# EAGLE design Int_Termostat (EAGLE 6.5.0)
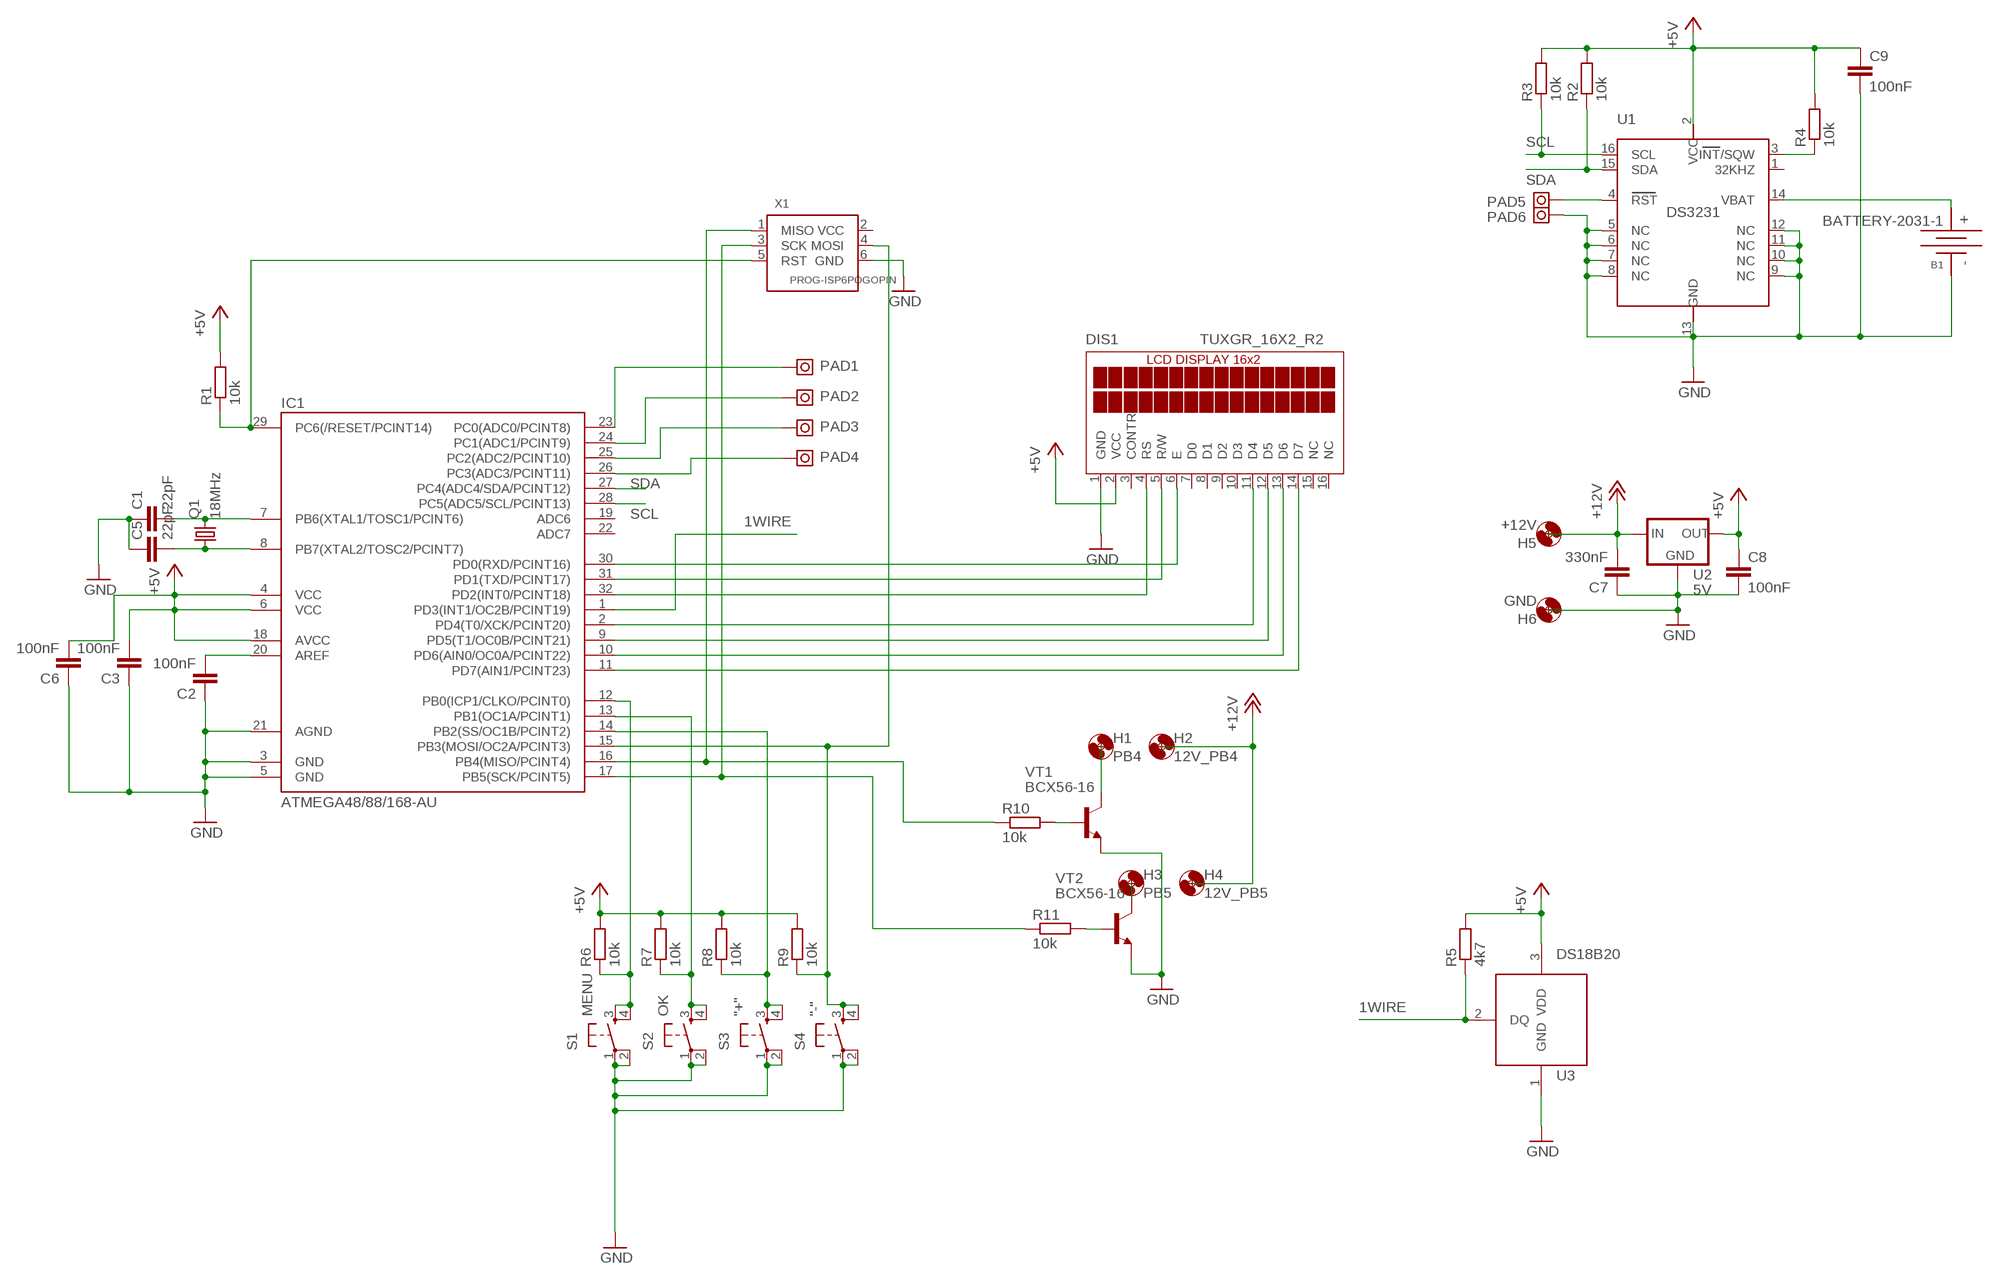
[diagram p0: schematic, sheet 1]

## Parts
B1  BATTERY-2031-1  [BTH2032-1]
C1  22pF  C-EUC0805  [C0805]
C2  100nF  C-EUC0805  [C0805]
C3  100nF  C-EUC0805  [C0805]
C5  22pF  C-EUC0805  [C0805]
C6  100nF  C-EUC0805  [C0805]
C7  330nF  C-EUC0805  [C0805]
C8  100nF  C-EUC0805  [C0805]
C9  100nF  C-EUC0805  [C0805]
DIS1  TUXGR_16X2_R2  [TUXGR_16X2_R2]
H1  PB4  MOUNT-HOLE3.0  [3,0]
H2  12V_PB4  MOUNT-HOLE3.0  [3,0]
H3  PB5  MOUNT-HOLE3.0  [3,0]
H4  12V_PB5  MOUNT-HOLE3.0  [3,0]
H5  +12V  MOUNT-HOLE3.0  [3,0]
H6  GND  MOUNT-HOLE3.0  [3,0]
IC1  ATMEGA48/88/168-AU  [TQFP32-08]
PAD1  PC0  PAD  [PAD]
PAD2  PC1  PAD  [PAD]
PAD3  PC2  PAD  [PAD]
PAD4  PC3  PAD  [PAD]
PAD5  RST  PAD  [PAD]
PAD6  RST  PAD  [PAD]
Q1  18MHz  CRYSTALHC49S  [HC49/S]
R1  10k  R-EU_R0603  [R0603]
R2  10k  R-EU_R0603  [R0603]
R3  10k  R-EU_R0603  [R0603]
R4  10k  R-EU_R0603  [R0603]
R5  4k7  R-EU_R0603  [R0603]
R6  10k  R-EU_R0603  [R0603]
R7  10k  R-EU_R0603  [R0603]
R8  10k  R-EU_R0603  [R0603]
R9  10k  R-EU_R0603  [R0603]
R10  10k  R-EU_R0603  [R0603]
R11  10k  R-EU_R0603  [R0603]
S1  MENU  DTS-6  [DTS-6]
S2  OK  DTS-6  [DTS-6]
S3  "+"  DTS-6  [DTS-6]
S4  "-"  DTS-6  [DTS-6]
U1  DS3231  [SO16]
U2  5V  L78XX/TO263  [TO263]
U3  DS18B20  [TO92]
VT1  BCX56-16  [SOT89-ECB]
VT2  BCX56-16  [SOT89-ECB]
X1  PROG-ISP6POGOPIN  [PROG_POGOPIN]

## Nets
1WIRE: IC1.1(PD3(INT1/OC2B/PCINT19)) R5.1 U3.2(DQ)
+5V: C3.2 C6.2 C8.1 C9.1 DIS1.2(VCC) IC1.4(VCC) IC1.6(VCC) IC1.18(AVCC) R1.2 R2.2 R3.2 R4.2 R5.2 R6.2 R7.2 R8.2 R9.2 U1.2(VCC) U2.2(OUT) U3.3(VDD)
+12V: C7.2 H2.P$1 H4.P$1 H5.P$1 U2.1(IN)
GND: B1.- C1.1 C2.1 C3.1 C5.1 C6.1 C7.1 C8.2 C9.2 DIS1.1(GND) H6.P$1 IC1.3(GND) IC1.5(GND) IC1.21(AGND) PAD6.P$1(PAD) S1.1 S1.2 S2.1 S2.2 S3.1 S3.2 S4.1 S4.2 U1.5(NC) U1.6(NC) U1.7(NC) U1.8(NC) U1.9(NC) U1.10(NC) U1.11(NC) U1.12(NC) U1.13(GND) U2.3(GND) U3.1(GND) VT1.E VT2.E X1.6(GND)
N$1: C1.2 IC1.7(PB6(XTAL1/TOSC1/PCINT6)) Q1.2
N$2: C5.2 IC1.8(PB7(XTAL2/TOSC2/PCINT7)) Q1.1
N$3: C2.2 IC1.20(AREF)
N$4: IC1.17(PB5(SCK/PCINT5)) R11.1 X1.3(SCK)
N$5: IC1.16(PB4(MISO/PCINT4)) R10.1 X1.1(MISO)
N$6: IC1.15(PB3(MOSI/OC2A/PCINT3)) R9.1 S4.3 S4.4 X1.4(MOSI)
N$7: B1.+ U1.14(VBAT)
N$9: IC1.29(PC6(/RESET/PCINT14)) R1.1 X1.5(RST)
N$10: R4.1 U1.3(INT/SQW)
N$11: DIS1.6(E) IC1.30(PD0(RXD/PCINT16))
N$12: DIS1.5(R/W) IC1.31(PD1(TXD/PCINT17))
N$13: DIS1.4(RS) IC1.32(PD2(INT0/PCINT18))
N$14: DIS1.11(D4) IC1.2(PD4(T0/XCK/PCINT20))
N$15: DIS1.12(D5) IC1.9(PD5(T1/OC0B/PCINT21))
N$16: DIS1.13(D6) IC1.10(PD6(AIN0/OC0A/PCINT22))
N$17: DIS1.14(D7) IC1.11(PD7(AIN1/PCINT23))
N$18: PAD5.P$1(PAD) U1.4(RST)
N$19: IC1.12(PB0(ICP1/CLKO/PCINT0)) R6.1 S1.3 S1.4
N$20: IC1.13(PB1(OC1A/PCINT1)) R7.1 S2.3 S2.4
N$21: IC1.14(PB2(SS/OC1B/PCINT2)) R8.1 S3.3 S3.4
N$22: H3.P$1 VT2.C VT2.C@1(C)
N$23: R10.2 VT1.B
N$24: R11.2 VT2.B
N$25: H1.P$1 VT1.C VT1.C@1(C)
N$26: IC1.23(PC0(ADC0/PCINT8)) PAD1.P$1(PAD)
N$27: IC1.24(PC1(ADC1/PCINT9)) PAD2.P$1(PAD)
N$28: IC1.25(PC2(ADC2/PCINT10)) PAD3.P$1(PAD)
N$29: IC1.26(PC3(ADC3/PCINT11)) PAD4.P$1(PAD)
SCL: IC1.28(PC5(ADC5/SCL/PCINT13)) R3.1 U1.16(SCL)
SDA: IC1.27(PC4(ADC4/SDA/PCINT12)) R2.1 U1.15(SDA)
Unconnected: DIS1.3(CONTR) DIS1.7(D0) DIS1.8(D1) DIS1.9(D2) DIS1.10(D3) DIS1.15(NC) DIS1.16(NC) IC1.19(ADC6) IC1.22(ADC7) U1.1(32KHZ) X1.2(VCC)

## Library data of the parts
B1 = usb:BATTERY
C1-C3 C5-C9 = rcl:C-EU: CAPACITOR, European symbol
DIS1 = display-lcd:TUXGR_16X2_R2: Tuxgraphics LCD display 16x2 characters reflective, without background light Source: tuxgr_12x2_r2.pdf; OC_FARNELL: unknown; OC_NEWARK: unknown
H1-H6 = holes:MOUNT-HOLE: MOUNTING HOLE with drill center marker
IC1 = atmega8:ATMEGA48/88/168
PAD1-PAD6 = usb:PAD
Q1 = crystal:CRYSTAL: CRYSTAL; OC_FARNELL: 1667008; OC_NEWARK: unknown
R1-R11 = rcl:R-EU_: RESISTOR, European symbol
S1-S4 = switch-tact:DTS-6
U1 = usb:DS3231
U2 = v-reg:L78XX/TO263
U3 = usb:DS18B20: DS18B20
VT1 VT2 = usb:BCX56-16
X1 = usb:PROG-ISP

## Board
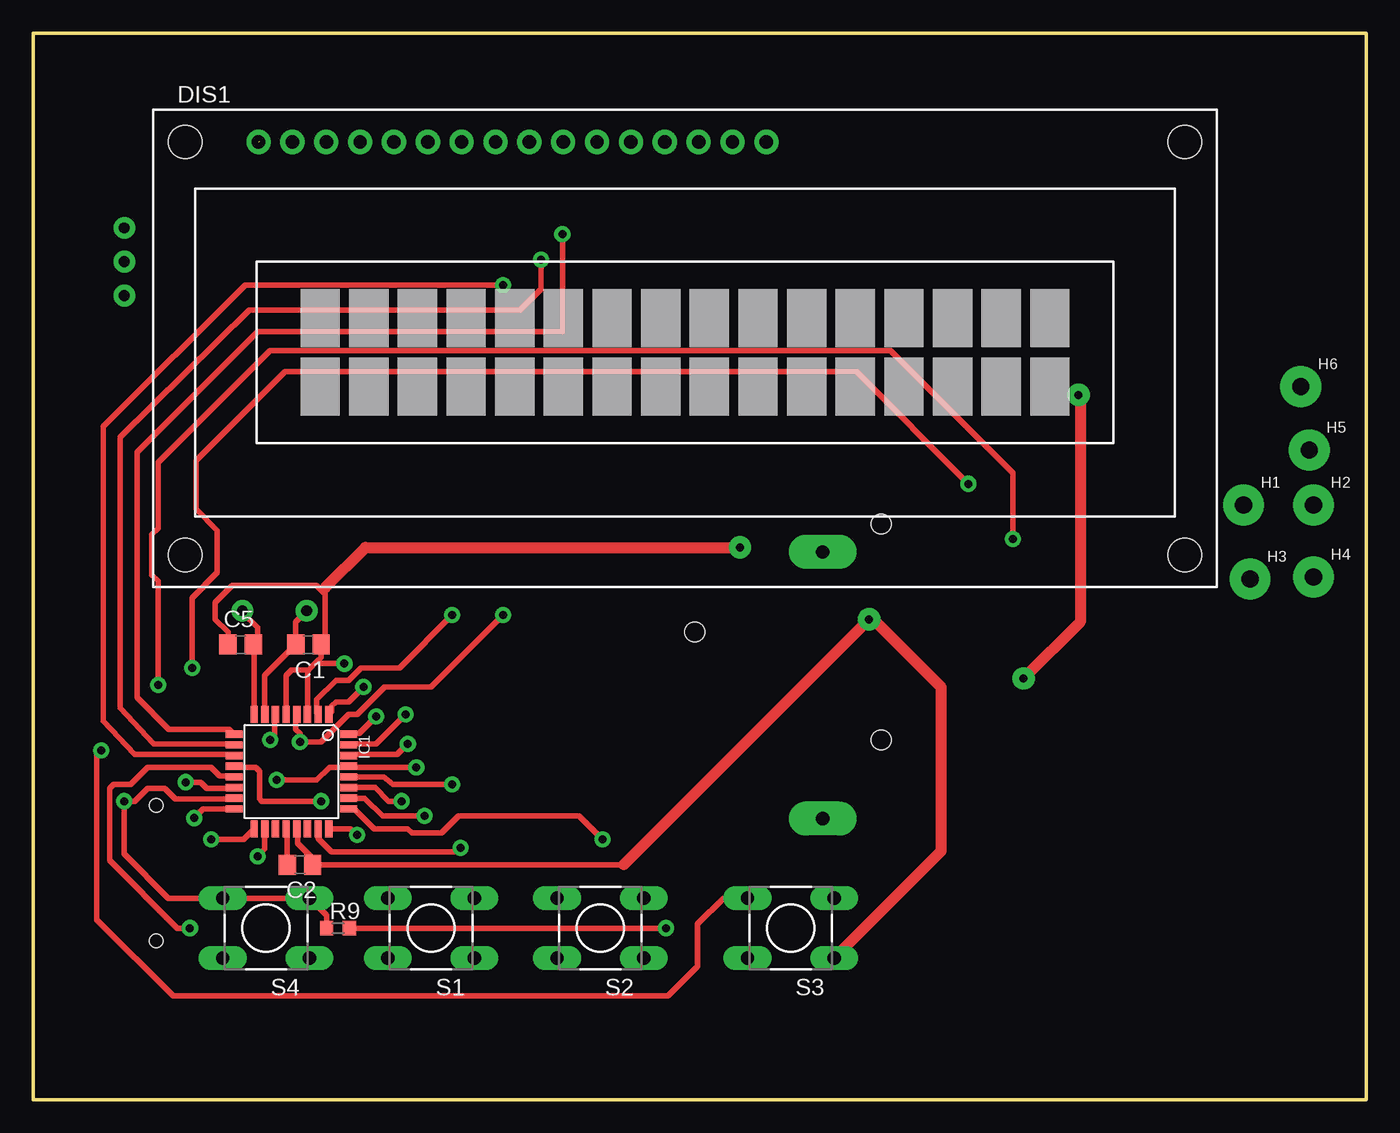
[diagram p1: board, top side]
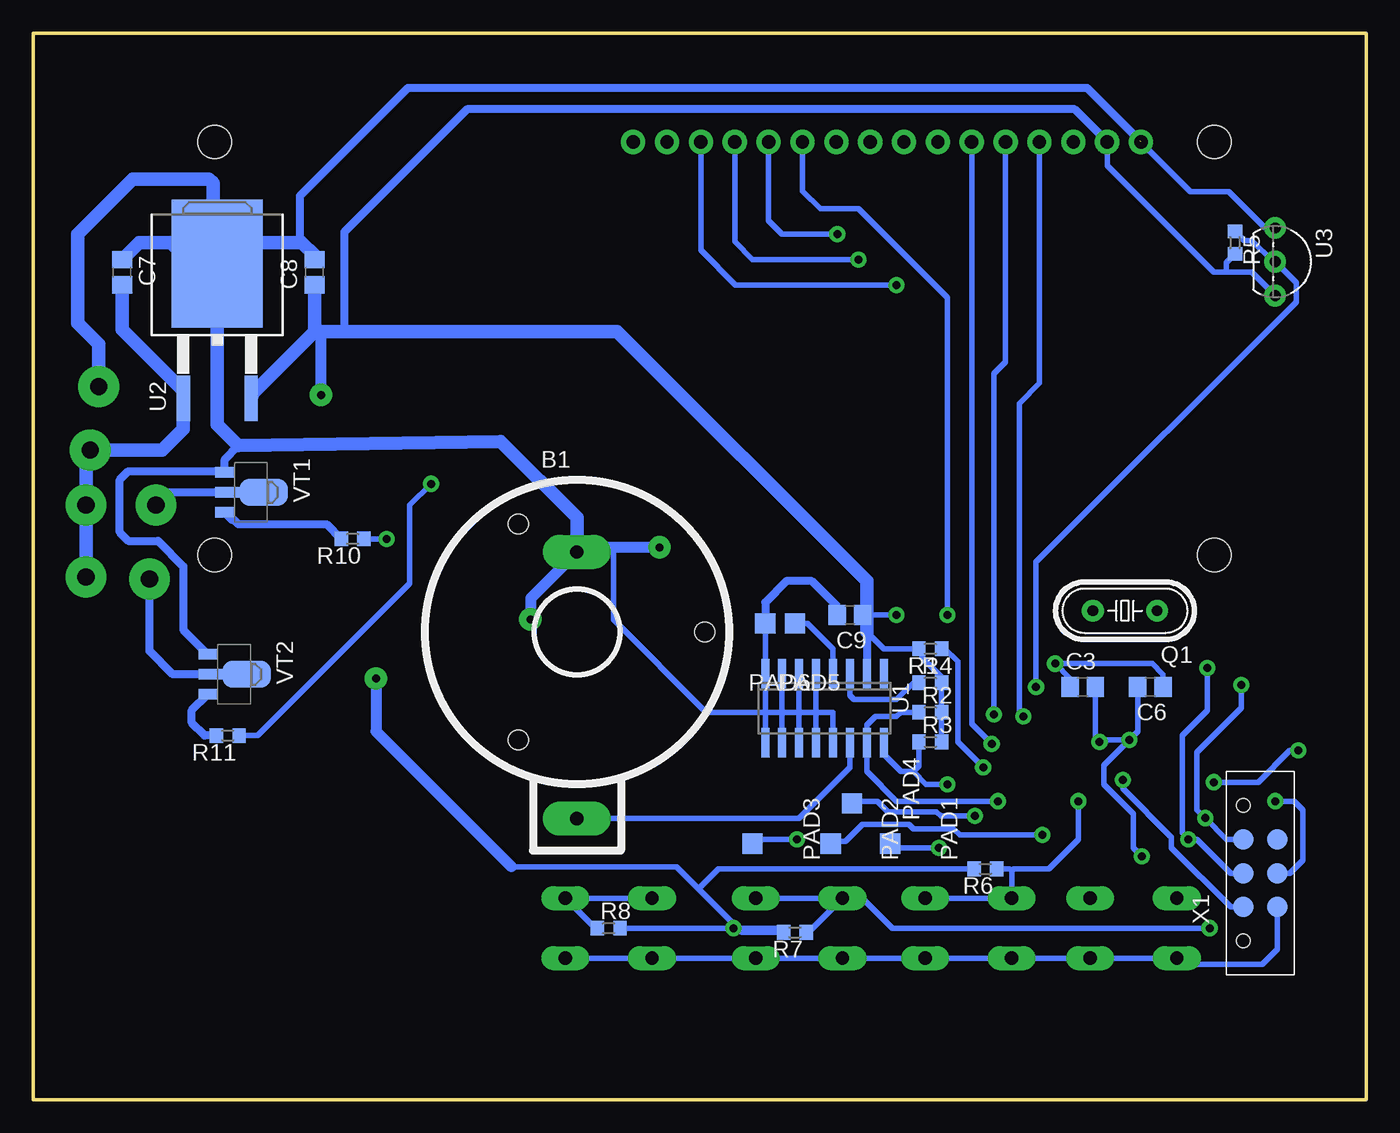
[diagram p2: board, bottom side, seen from below]

Size 100 x 80 mm. Coordinates in mm from the lower left corner, seen from the top.
Outline: 0,0 100,0 100,80 0,80 0,0
Copper layers (1*16): Top 0.035mm / dielectric 1.5mm / Bottom 0.035mm
Design rules "default": minimum track width 12mil, minimum drill 32mil, track to track 12mil, track to pad 12mil, pad to pad 12mil, via to via 12mil, smd to smd 8mil, copper to edge 40mil, drill to drill 8mil, minimum pad ring 16mil, minimum via ring 12mil, stop-mask expansion 4mil, vias tented up to drill 0mil, thermal gap 20mil

### Footprints (pad centres in the part's own frame; a part is rotated, then mirrored left to right if it is on the bottom)
BTH2032-1 = drill 1 pad 2.54 long: + 0,-14; - 0,6 | hole 1.5: -4.4,8.1; -4.4,-8.1; 9.6,0
C0805 = smd 1.3 x 1.5: 1 -0.95,0; 2 0.95,0
TUXGR_16X2_R2 = drill 1 pad 1.676: 1 -32,15.5; 2 -29.46,15.5; 3 -26.92,15.5; 4 -24.38,15.5; 5 -21.84,15.5; 6 -19.3,15.5; 7 -16.76,15.5; 8 -14.22,15.5; 9 -11.68,15.5; 10 -9.14,15.5; 11 -6.6,15.5; 12 -4.06,15.5; 13 -1.52,15.5; 14 1.02,15.5; 15 3.56,15.5; 16 6.1,15.5 | hole 2.5: -37.5,-15.5; 37.5,-15.5; -37.5,15.5; 37.5,15.5
3,0 = drill 1.3 pad 3.048: P$1 0,0
TQFP32-08 = smd 1.27 x 0.559: 1 -4.293,2.8; 2 -4.293,2; 3 -4.293,1.2; 4 -4.293,0.4; 5 -4.293,-0.4; 6 -4.293,-1.2; 7 -4.293,-2; 8 -4.293,-2.8; 17 4.293,-2.8; 18 4.293,-2; 19 4.293,-1.2; 20 4.293,-0.4; 21 4.293,0.4; 22 4.293,1.2; 23 4.293,2; 24 4.293,2.8 | smd 0.559 x 1.27: 9 -2.8,-4.293; 10 -2,-4.293; 11 -1.2,-4.293; 12 -0.4,-4.293; 13 0.4,-4.293; 14 1.2,-4.293; 15 2,-4.293; 16 2.8,-4.293; 25 2.8,4.293; 26 2,4.293; 27 1.2,4.293; 28 0.4,4.293; 29 -0.4,4.293; 30 -1.2,4.293; 31 -2,4.293; 32 -2.8,4.293
PAD = smd 1.524 x 1.524: P$1 0,0
HC49/S = drill 0.813: 1 -2.413,0; 2 2.413,0
R0603 = smd 1 x 1.1: 1 -0.85,0; 2 0.85,0
DTS-6 = drill 1 long: 1 -3.25,2.25; 2 3.25,2.25; 3 -3.25,-2.25; 4 3.25,-2.25
SO16 = smd 0.6 x 2.2: 1 -4.445,-2.6; 2 -3.175,-2.6; 3 -1.905,-2.6; 4 -0.635,-2.6; 5 0.635,-2.6; 6 1.905,-2.6; 7 3.175,-2.6; 8 4.445,-2.6; 9 4.445,2.6; 10 3.175,2.6; 11 1.905,2.6; 12 0.635,2.6; 13 -0.635,2.6; 14 -1.905,2.6; 15 -3.175,2.6; 16 -4.445,2.6
TO263 = smd 1 x 3.4: 1 -2.54,-6.6; 2 2.54,-6.6 | smd 6.8 x 9.6: 3 0,3.5
TO92 = drill 0.813: 1 -2.54,0; 2 0,0; 3 2.54,0
SOT89-ECB = smd 0.8 x 1.4: B 1.499,-1.981; E -1.499,-1.981 | smd 0.8 x 1.9: C 0,-1.727 | smd 2.032 x 3.65: C@1 0,0.94
PROG_POGOPIN = smd 1.524 x 1.524: 1 0,7.62; 2 2.54,7.62; 3 0,5.08; 4 2.54,5.08; 5 0,2.54; 6 2.54,2.54 | hole 1.016: 0,0; 0,10.16

### Placement (x,y rotation side)
B1  59.21,35.08 0 bottom
C1  20.64,34.13 180 top
C2  20,17.62 180 top
C3  21.27,30.96 0 bottom
C5  15.56,34.13 0 top
C6  16.19,30.96 180 bottom
C7  93.34,62.07 270 bottom
C8  78.9,62.07 90 bottom
C9  38.73,36.35 180 bottom
DIS1  48.9,56.36 0 top
H1  90.81,44.61 0 top
H2  96.04,44.61 0 top
H3  91.28,39.05 0 top
H4  96.04,39.21 0 top
H5  95.73,48.74 0 top
H6  95.09,53.5 0 top
IC1  19.37,24.61 270 top
PAD1  35.72,19.21 90 bottom
PAD2  40.16,19.21 90 bottom
PAD3  46.04,19.21 90 bottom
PAD4  38.58,22.23 90 bottom
PAD5  42.86,35.72 0 bottom
PAD6  45.09,35.72 0 bottom
Q1  18.1,36.67 180 bottom
R1  32.7,33.81 180 bottom
R2  32.7,29.05 0 bottom
R3  32.7,26.83 0 bottom
R4  32.7,31.27 0 bottom
R5  9.84,64.29 270 bottom
R6  28.57,17.3 180 bottom
R7  42.86,12.54 180 bottom
R8  56.83,12.86 0 bottom
R9  22.86,12.86 0 top
R10  76.04,42.07 180 bottom
R11  85.41,27.3 180 bottom
S1  29.84,12.86 180 top
S2  42.55,12.86 180 top
S3  56.83,12.86 180 top
S4  17.46,12.86 180 top
U1  40.64,29.37 180 bottom
U2  86.2,59.21 0 bottom
U3  6.83,62.87 270 bottom
VT1  83.66,45.56 270 bottom
VT2  84.93,31.91 270 bottom
X1  9.21,11.91 0 bottom

### Tracks (layer width: path | path; a pad name or v marks a point on that pad's centre or on a via)
1WIRE  (via drill 0.6)
  Top 0.406: v24.77,30.96 23.65,29.84 22.7,29.84 22.38,29.53 22.38,29.11 IC1.1
  Bottom 0.406: R5.1 9.15,64.45 8.57,64.45 6.99,62.87 U3.2 5.24,61.28 5.24,59.85 24.77,40.32 v24.77,30.96
+5V  (via drill 0.6, 0.6 pad 1.68)
  Top 0.406: IC1.4 19.68,28.82 19.68,27.78 20,27.46 v20,26.83 21.59,26.83 23.65,28.89 24.29,28.89 26.35,30.96 29.84,30.96 v35.24,36.35 | v17.78,26.99 17.78,27.15 18.1,27.46 18.1,28.83 IC1.6 | IC1.18 17.37,18.8 v16.83,18.26 | 78.58,52.7 v78.42,52.86 | R9.2 v47.47,12.86
  Top 0.813: v74.3,31.59 78.58,35.88 78.58,52.7
  Bottom 0.406: C3.2 20.32,26.99 v20,26.83 19.84,26.99 v17.78,26.99 | C6.2 17.14,27.62 v17.78,26.99 | R3.2 R2.2 R4.2 31.85,31.69 33.34,33.18 33.34,33.6 R1.2 36.2,33.81 37.47,35.08 | U3.3 8.57,62.07 10.48,62.07 | 10.48,62.07 11.43,62.07 19.43,70.08 DIS1.2 | R5.2 10.48,62.81 10.48,62.07 | v35.24,36.35 C9.1 37.47,36.35 37.47,36.2 | v16.83,18.26 17.46,18.89 17.46,21.43 19.68,23.65 19.68,25.08 v17.78,26.99 | R8.2 v47.47,12.86 44.03,12.86 R7.2 46.83,12.54 50.09,15.8 | 50.09,15.8 51.75,17.46 64.14,17.46 | 78.42,57.31 78.74,57.63 | R6.2 48.58,17.3 50.09,15.8
  Bottom 0.61: 37.47,35.08 U1.2 | DIS1.2 21.87,74.3 67.47,74.3 76.68,65.09 76.68,57.63
  Bottom 0.813: v78.42,52.86 78.42,57.31 | v74.3,31.59 74.3,27.62 64.14,17.46
  Bottom 1.016: C8.1 78.9,57.63 | 78.9,57.63 83.5,53.02 U2.2 | 78.9,57.63 78.74,57.63 76.68,57.63 56.2,57.63 37.47,38.89 37.47,36.2 37.47,35.08
+12V
  Bottom 1.016: C7.2 93.34,57.78 88.74,53.18 U2.1 88.74,50.32 90.33,48.74 H5.P$1 96.04,48.42 H2.P$1 H4.P$1
GND  (via drill 0.6, 0.6 pad 1.68)  (1 unrouted)
  Top 0.406: C5.1 14.61,35.08 13.65,36.04 13.65,37.31 14.92,38.58 21.27,38.58 21.91,37.94 | 21.91,37.94 21.91,34.45 | 21.91,34.45 C1.1 21.59,33.18 | 21.59,33.18 21.27,32.86 | 21.27,32.86 20.64,32.23 | IC1.3 20.57,32.16 20.64,32.23 | v23.34,32.7 21.59,32.7 21.27,32.86 | IC1.5 18.97,31.83 19.37,32.23 20.64,32.23 | 21.59,33.18 C1.1 21.91,34.45 | 21.91,37.94 21.91,38.42 | IC1.21 19.84,20.24 19.84,19.21 20.95,18.1 C2.1 44.29,17.62 | v62.71,36.04 63.02,36.04
  Top 0.813: 21.91,38.42 24.92,41.43 v53.02,41.43 | 44.29,17.62 v62.71,36.04 | 63.02,36.04 68.1,30.96 68.1,18.63 S3.1
  Bottom 0.406: C3.1 22.22,31.59 v23.34,32.7 16.03,32.7 15.24,31.91 C6.1 | U1.5 41.27,29.05 | 41.27,29.05 U1.12 | 42.55,29.05 U1.11 | 43.81,29.05 U1.10 | 45.09,29.05 U1.9 | U1.6 42.55,29.05 | 42.55,29.05 41.27,29.05 | U1.7 43.81,29.05 | 43.81,29.05 42.55,29.05 | 45.09,29.05 U1.8 PAD6.P$1 | 45.09,29.05 43.81,29.05 | U1.13 40.01,29.05 41.27,29.05 | 45.09,29.05 49.53,29.05 56.48,36 56.48,41.08 B1.- 58.9,41.4 | X1.6 6.67,11.27 7.78,10.16 14.5,10.16 S4.2 S4.1 S1.2 S1.1 S2.2 S2.1 S3.2 S3.1 | U3.1 7.62,65.41 10.32,68.1 13.18,68.1 16.99,71.91
  Bottom 0.61: C9.2 39.69,36.99 41.59,38.89 43.5,38.89 45.09,37.31 PAD6.P$1 | 84.61,49.05 85.64,48.02 VT1.E 85.73,47.15 92.87,47.15 93.5,46.51 93.5,42.55 92.87,41.91 90.65,41.91 88.74,40.01 88.74,35.24 VT2.E | DIS1.1 20.92,75.88 71.91,75.88 80.01,67.79 80.01,64.29
  Bottom 0.813: v53.02,41.43 58.9,41.4 | v62.71,36.04 62.67,37.62 B1.-
  Bottom 1.016: U2.3 88.11,62.71 89.69,64.29 92.07,64.29 C7.1 | C8.2 78.9,63.34 79.85,64.29 80.01,64.29 84.62,64.29 85.73,63.19 | 85.73,63.19 U2.3 | H6.P$1 95.09,56.67 96.68,58.26 96.68,64.93 92.55,69.06 86.84,69.06 86.52,68.74 86.52,63.98 85.73,63.19 | U2.3 86.2,50.64 84.61,49.05 64.93,49.37 59.21,43.66 B1.-
N$1
  Top 0.406: Q1.2 19.69,35.85 C1.2 17.37,31.81 IC1.7
N$2
  Top 0.406: Q1.1 15.68,36.54 16.83,35.4 16.83,34.45 C5.2 16.57,34.07 IC1.8
N$3
  Top 0.406: C2.2 19.05,20.23 IC1.20
N$4  (via drill 0.6)
  Top 0.406: v13.34,19.53 15.78,19.53 IC1.17 | v70.17,46.2 61.75,54.61 18.89,54.61 12.22,47.94 12.22,44.29 13.81,42.7 13.81,39.53 11.91,37.62 v11.91,32.38
  Bottom 0.406: X1.3 10.16,16.99 12.7,19.53 v13.34,19.53 13.81,20 13.81,27.3 11.91,29.21 v11.91,32.38 | R11.1 83.19,27.3 71.75,38.73 71.75,44.61 v70.17,46.2
N$5  (via drill 0.6)
  Top 0.406: v9.37,31.11 9.37,38.89 8.89,39.37 8.89,42.39 9.37,42.86 9.37,47.78 17.78,56.2 64.29,56.2 73.5,46.99 v73.5,42.07 | IC1.16 12.76,21.81 v12.06,21.11
  Bottom 0.406: X1.1 10.48,19.53 v12.06,21.11 12.7,21.75 12.7,26.04 9.37,29.37 v9.37,31.11 | R10.1 v73.5,42.07
N$6  (via drill 0.6)
  Top 0.406: IC1.15 14.98,22.54 10.64,22.54 9.84,23.34 8.57,23.34 7.62,22.38 v6.83,22.38 6.83,18.41 10.13,15.11 S4.4 S4.3 22.01,13.81 R9.1
  Bottom 0.406: X1.4 5.71,16.99 4.76,17.94 4.76,21.75 5.4,22.38 v6.83,22.38
N$7
  Bottom 0.406: B1.+ 42.58,21.08 38.73,24.92 U1.14
N$9  (via drill 0.6)
  Top 0.406: v18.26,23.97 21.27,23.97 22.23,24.92 23.58,24.92 IC1.29 23.74,24.92 v28.73,24.92
  Bottom 0.406: X1.5 10.16,14.45 14.61,18.89 14.61,19.68 18.26,23.34 v18.26,23.97 | R1.1 31.59,33.81 30.64,32.86 30.64,26.83 v28.73,24.92
N$10
  Bottom 0.406: R4.1 33.97,31.27 35.24,30 38.42,30 38.73,30.32 U1.3
N$11  (via drill 0.6)
  Top 0.406: v28.1,26.67 27.3,25.88 23.73,25.88 IC1.30
  Bottom 0.406: DIS1.6 29.59,28.17 v28.1,26.67
N$12  (via drill 0.6)
  Top 0.406: v27.94,28.89 25.72,26.67 23.6,26.67 IC1.31
  Bottom 0.406: DIS1.5 27.05,55.34 27.94,54.45 v27.94,28.89
N$13  (via drill 0.6)
  Top 0.406: v25.72,28.73 24.45,27.46 23.72,27.46 IC1.32
  Bottom 0.406: DIS1.4 24.52,53.75 26.04,52.23 26.04,29.05 v25.72,28.73
N$14  (via drill 0.6)
  Top 0.406: IC1.2 21.27,28.99 21.27,30 22.7,31.43 23.65,31.43 24.61,32.38 27.46,32.38 v31.43,36.35
  Bottom 0.406: DIS1.11 42.3,68.17 40.96,66.83 38.1,66.83 31.43,60.17 v31.43,36.35
N$15  (via drill 0.6)
  Top 0.406: IC1.9 14.7,27.78 10.16,27.78 7.78,30.16 7.78,48.58 16.83,57.63 39.69,57.63 v39.69,64.93
  Bottom 0.406: DIS1.12 44.84,65.95 43.81,64.93 v39.69,64.93
N$16  (via drill 0.6)
  Top 0.406: IC1.10 14.98,26.67 9.05,26.67 6.51,29.37 6.51,49.69 16.19,59.21 36.51,59.21 38.1,60.8 v38.1,63.02
  Bottom 0.406: DIS1.13 47.38,64.36 46.04,63.02 v38.1,63.02
N$17  (via drill 0.6)
  Top 0.406: IC1.11 15.01,25.88 7.62,25.88 5.24,28.42 5.24,50.48 15.88,61.12 v35.24,61.12
  Bottom 0.406: DIS1.14 49.91,63.73 47.31,61.12 v35.24,61.12
N$18
  Bottom 0.406: PAD5.P$1 41.91,35.72 40.01,33.81 U1.4
N$19  (via drill 0.6)
  Top 0.406: v21.59,22.38 17.14,22.38 16.99,22.54 16.99,24.61 16.67,24.92 15.16,24.92 IC1.12
  Bottom 0.406: 26.59,17.14 S1.4 S1.3 | v21.59,22.38 21.59,19.53 23.81,17.3 26.44,17.3 26.59,17.14 | R6.1 26.75,17.3 26.59,17.14
N$20  (via drill 0.6)
  Top 0.406: v11.75,12.86 10.79,12.86 5.71,17.94 5.71,23.34 6.03,23.65 7.3,23.65 8.57,24.92 13.34,24.92 13.97,24.29 14.99,24.29 IC1.13
  Bottom 0.406: S2.4 37.81,15.11 35.56,12.86 v11.75,12.86 | S2.4 S2.3 | R7.1 41.86,12.54 S2.4
N$21  (via drill 0.6)
  Top 0.406: S3.4 51.78,15.11 49.85,13.18 49.85,10 47.62,7.78 10.48,7.78 4.76,13.49 4.76,25.88 v5.08,26.19 | v11.43,23.81 12.54,23.81 13.02,23.34 15.01,23.34 IC1.14
  Bottom 0.406: v5.08,26.19 5.71,26.19 8.1,23.81 v11.43,23.81 | S3.4 S3.3 57.83,12.86 R8.1
N$22
  Bottom 0.406: VT2.C@1 VT2.C
  Bottom 0.61: VT2.C 89.53,31.91 91.28,33.66 H3.P$1
N$23
  Bottom 0.406: 85.57,43.99 VT1.B
  Bottom 0.61: 85.57,43.99 85.57,43.97 85.09,43.5 84.93,43.5 84.61,43.18 78,43.18 R10.2
N$24
  Bottom 0.61: R11.2 87.15,27.3 88.11,28.26 88.11,29.22 VT2.B
N$25
  Bottom 0.61: VT1.C@1 VT1.C 89.85,45.56 H1.P$1
N$26  (via drill 0.6)
  Top 0.406: IC1.23 21.37,19.59 22.38,18.57 31.75,18.57 v32.07,18.89
  Bottom 0.406: v32.07,18.89 35.24,18.89 PAD1.P$1
N$27  (via drill 0.6)
  Top 0.406: IC1.24 23.82,20.31 v24.29,19.84
  Bottom 0.406: PAD2.P$1 40.01,19.37 39.05,19.37 37.78,20.64 34.29,20.64 33.97,20.32 30.96,20.32 30.48,19.84 v24.29,19.84
N$28  (via drill 0.6)
  Top 0.406: IC1.25 24.07,21.81 25.56,20.32 28.1,20.32 28.42,20 30.64,20 31.91,21.27 40.96,21.27 v42.7,19.53
  Bottom 0.406: v42.7,19.53 45.72,19.53 PAD3.P$1
N$29  (via drill 0.6)
  Top 0.406: IC1.26 24.86,22.61 26.19,21.27 v29.37,21.27
  Bottom 0.406: v29.37,21.27 31.91,21.27 32.23,21.59 35.88,21.59 36.67,22.38 38.42,22.38 PAD4.P$1
SCL  (via drill 0.6)
  Top 0.406: IC1.28 26.27,24.21 26.99,23.65 v31.43,23.65
  Bottom 0.406: v31.43,23.65 33.02,23.65 33.97,24.61 | 33.97,24.61 34.92,24.61 36.2,25.88 U1.16 | R3.1 33.55,25.03 33.97,24.61
SDA  (via drill 0.6)
  Top 0.406: IC1.27 25.65,23.41 26.67,22.38 v27.62,22.38
  Bottom 0.406: v27.62,22.38 35.24,22.38 37.47,24.61 U1.15 37.47,28.1 36.83,28.73 35.24,28.73 34.92,29.05 R2.1